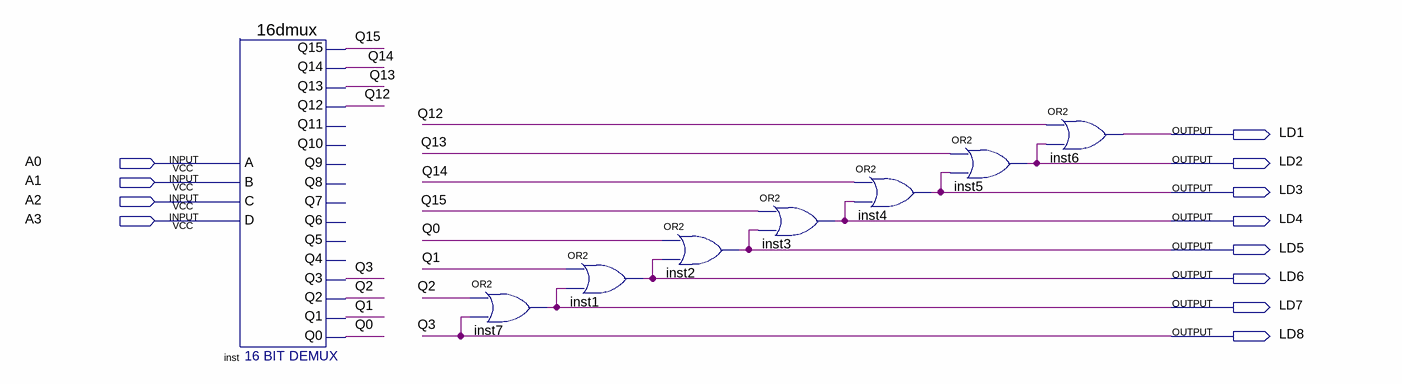
[diagram p0: schematic sheet]
// Quartus schematic DMUX.bdf as structural Verilog: 8 symbols, 12 pins
module DMUX (
  input  A0,
  input  A1,
  input  A2,
  input  A3,
  output LD1,
  output LD2,
  output LD3,
  output LD4,
  output LD5,
  output LD6,
  output LD7,
  output LD8
);

  wire Q0, Q1, Q2, Q12, Q13, Q14, Q15;

  \16dmux  inst (
    .C(A2), .B(A1), .A(A0), .D(A3), .Q12(Q12), .Q13(Q13), .Q2(Q2), .Q3(LD8), .Q14(Q14), .Q15(Q15), .Q0(Q0),
    .Q1(Q1));  // open: Q11, Q9, Q10, Q7, Q8, Q4, Q5, Q6
  or inst7 (LD7, Q2, LD8);
  or inst1 (LD6, Q1, LD7);
  or inst2 (LD5, Q0, LD6);
  or inst3 (LD4, Q15, LD5);
  or inst4 (LD3, Q14, LD4);
  or inst5 (LD2, Q13, LD3);
  or inst6 (LD1, Q12, LD2);

  // Other names for the same wires on the sheet: Q3 = LD8
endmodule
